# EAGLE schematic Adafruit Crickit FeatherWing (EAGLE 9.0.0)

## Sheet 1 of 3
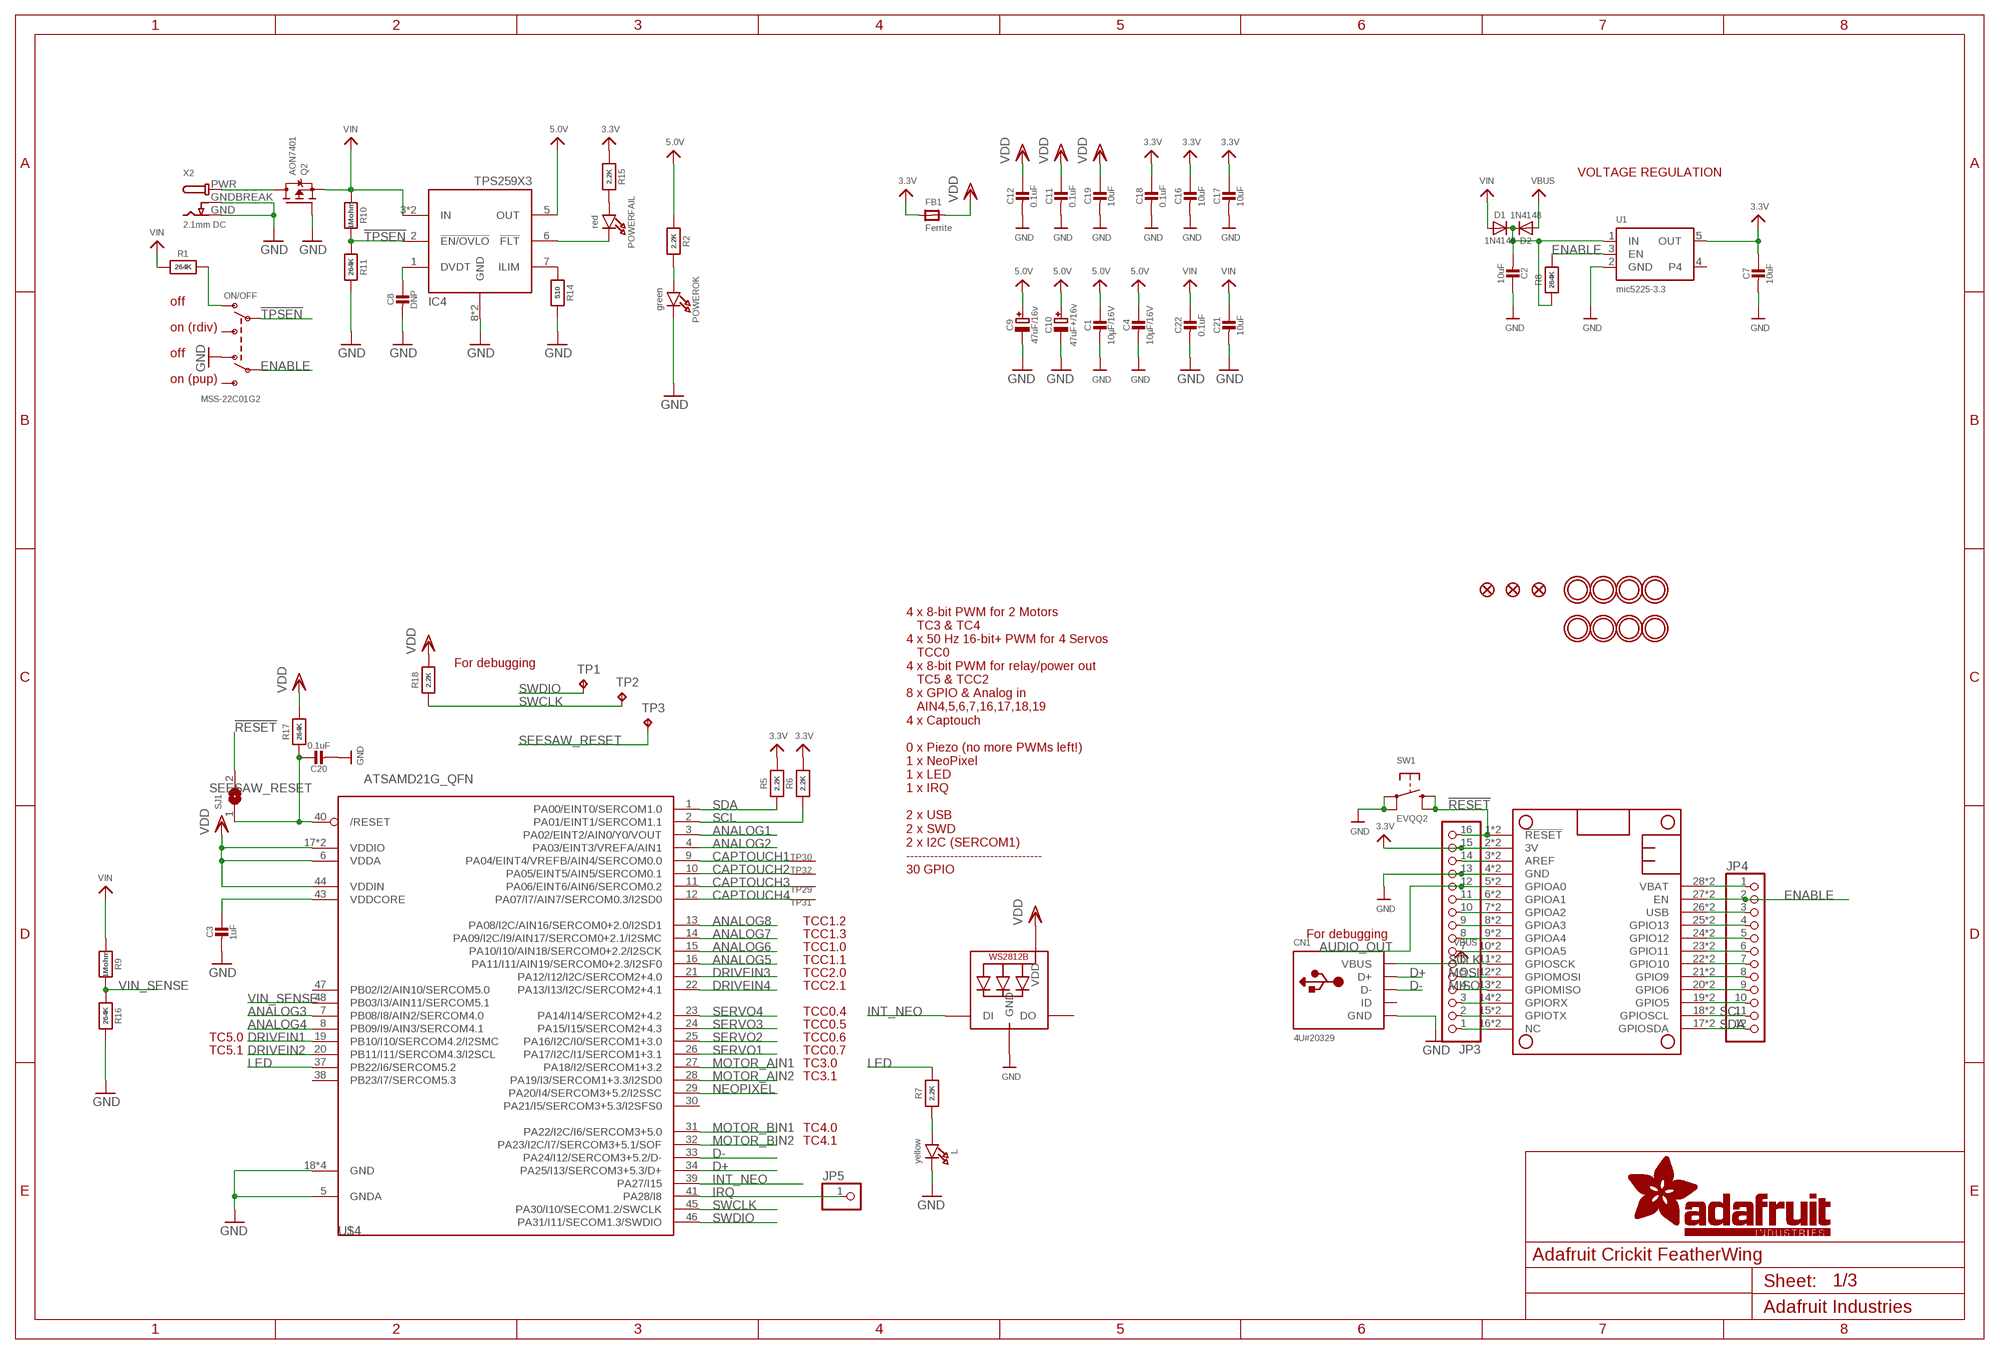
[diagram p0: schematic, sheet 1]

### Parts
C1  10µF/16V  CAP_CERAMIC0805-NOOUTLINE  [0805-NO]
C2  10uF  CAP_CERAMIC0805-NOOUTLINE  [0805-NO]
C3  1uF  CAP_CERAMIC0805_10MGAP  [0805_10MGAP]
C4  10µF/16V  CAP_CERAMIC0805-NOOUTLINE  [0805-NO]
C7  10uF  CAP_CERAMIC0805-NOOUTLINE  [0805-NO]
C8  DNP  CAP_CERAMIC0603_NO  [0603-NO]
C9  47uF/16v  CAP_ELECTROLYTICPANASONIC_C  [PANASONIC_C]
C10  47uF+/16v  CAP_ELECTROLYTICPANASONIC_C  [PANASONIC_C]
C11  0.1uF  CAP_CERAMIC0805-NOOUTLINE  [0805-NO]
C12  0.1uF  CAP_CERAMIC0805-NOOUTLINE  [0805-NO]
C16  10uF  CAP_CERAMIC0805-NOOUTLINE  [0805-NO]
C17  10uF  CAP_CERAMIC0805-NOOUTLINE  [0805-NO]
C18  0.1uF  CAP_CERAMIC0805-NOOUTLINE  [0805-NO]
C19  10uF  CAP_CERAMIC0805-NOOUTLINE  [0805-NO]
C20  0.1uF  CAP_CERAMIC0805-NOOUTLINE  [0805-NO]
C21  10uF  CAP_CERAMIC0805-NOOUTLINE  [0805-NO]
C22  0.1uF  CAP_CERAMIC0805-NOOUTLINE  [0805-NO]
CN1  4U#20329  USB_MICRO_20329_V2  [4UCONN_20329_V2]
D1  1N4148  DIODESOD-323  [SOD-323]
D2  1N4148  DIODESOD-323  [SOD-323]
FB1  Ferrite  FERRITE-0805NO  [0805-NO]
FID1  FIDUCIAL_1MM  [FIDUCIAL_1MM]
FID2  FIDUCIAL_1MM  [FIDUCIAL_1MM]
FID3  FIDUCIAL_1MM  [FIDUCIAL_1MM]
IC4  TPS259573  TPS2595X3  [WSON8]
JP3  HEADER-1X16ROUND  [1X16_ROUND]
JP4  HEADER-1X12  [1X12_ROUND]
JP5  HEADER-1X1ROUND  [1X01_ROUND]
L  yellow  LED0805_NOOUTLINE  [CHIPLED_0805_NOOUTLINE]
LED1  WS2812B3535  [LED3535]
MS2  FEATHERWING_SMTDUAL  [FEATHERWING_SMT2]
ON/OFF  MSS-22C01G2  SWITCH_DPDTEG1390  [EG1390]
POWERFAIL  red  LED0805_NOOUTLINE  [CHIPLED_0805_NOOUTLINE]
POWEROK  green  LED0805_NOOUTLINE  [CHIPLED_0805_NOOUTLINE]
Q2  AON7401  MOSFET-P-POWERDI3333  [POWERDI3333]
R1  264K  RESISTOR_0603_NOOUT  [0603-NO]
R2  2.2K  RESISTOR_0603_NOOUT  [0603-NO]
R5  2.2K  RESISTOR_0603_NOOUT  [0603-NO]
R6  2.2K  RESISTOR_0603_NOOUT  [0603-NO]
R7  2.2K  RESISTOR_0603_NOOUT  [0603-NO]
R8  264K  RESISTOR_0603_NOOUT  [0603-NO]
R9  1Mohm  RESISTOR_0603_NOOUT  [0603-NO]
R10  1Mohm  RESISTOR_0603_NOOUT  [0603-NO]
R11  264K  RESISTOR_0603_NOOUT  [0603-NO]
R14  510  RESISTOR_0603_NOOUT  [0603-NO]
R15  2.2K  RESISTOR_0603_NOOUT  [0603-NO]
R16  264K  RESISTOR_0603_NOOUT  [0603-NO]
R17  264K  RESISTOR_0603_NOOUT  [0603-NO]
R18  2.2K  RESISTOR_0603_NOOUT  [0603-NO]
SJ1  SOLDERJUMPERCLOSED  [SOLDERJUMPER_CLOSEDWIRE]
SW1  EVQQ2  SWITCH_TACT_SMT_EVQQ2_SMALL  [EVQ-Q2_SMALLER]
TP1  TPTP15R  [TP15R]
TP2  TPTP15R  [TP15R]
TP3  TPTP15R  [TP15R]
TP29  SEWTAPPCB_ALLIGATOR  [PCB_ALLI]
TP30  SEWTAPPCB_ALLIGATOR  [PCB_ALLI]
TP31  SEWTAPPCB_ALLIGATOR  [PCB_ALLI]
TP32  SEWTAPPCB_ALLIGATOR  [PCB_ALLI]
U1  mic5225-3.3  VREG_SOT23-5  [SOT23-5]
U$4  ATSAMD21G_QFN  [TQFN48_7MM]
U$41  MOUNTINGHOLE3.0_NPH  [MOUNTINGHOLE_3.0_NPH]
U$42  MOUNTINGHOLE3.0_NPH  [MOUNTINGHOLE_3.0_NPH]
U$43  MOUNTINGHOLE3.0_NPH  [MOUNTINGHOLE_3.0_NPH]
U$44  MOUNTINGHOLE3.0_NPH  [MOUNTINGHOLE_3.0_NPH]
U$49  MOUNTINGHOLE3.0_NPH  [MOUNTINGHOLE_3.0_NPH]
U$50  MOUNTINGHOLE3.0_NPH  [MOUNTINGHOLE_3.0_NPH]
U$51  MOUNTINGHOLE3.0_NPH  [MOUNTINGHOLE_3.0_NPH]
U$52  MOUNTINGHOLE3.0_NPH  [MOUNTINGHOLE_3.0_NPH]
X2  2.1mm DC  DCBARRELPTH  [DCJACK_2MM_PTH]

### Nets
3.3V [thickpower]: C7.1 C16.1 C17.1 C18.1 FB1.1 JP3.15 MS2.2'(3V) MS2.2(3V) R5.2 R6.2 R15.1 U1.5(OUT) ; also sheet 2,3
5.0V [thickpower]: C1.1 C4.1 C9.+ C10.+ IC4.5(OUT) R2.1 ; also sheet 2,3
!RESET: JP3.16 MS2.1'(!RESET) MS2.1(!RESET) SJ1.2 SW1.B'(S1) SW1.B(S)
!TPSEN: IC4.2(!EN/OVLO) ON/OFF.P1 R10.2 R11.1
ANALOG1: U$4.3(PA02/EINT2/AIN0/Y0/VOUT) ; also sheet 3
ANALOG2: U$4.4(PA03/EINT3/VREFA/AIN1) ; also sheet 3
ANALOG3: U$4.7(PB08/I8/AIN2/SERCOM4.0) ; also sheet 3
ANALOG4: U$4.8(PB09/I9/AIN3/SERCOM4.1) ; also sheet 3
ANALOG5: U$4.16(PA11/I11/AIN19/SERCOM0+2.3/I2SF0) ; also sheet 3
ANALOG6: U$4.15(PA10/I10/AIN18/SERCOM0+2.2/I2SCK) ; also sheet 3
ANALOG7: U$4.14(PA09/I2C/I9/AIN17/SERCOM0+2.1/I2SMC) ; also sheet 3
ANALOG8: U$4.13(PA08/I2C/AIN16/SERCOM0+2.0/I2SD1) ; also sheet 3
AREF: JP3.14 MS2.3'(AREF) MS2.3(AREF)
AUDIO_OUT: JP3.12 MS2.5'(GPIOA0) MS2.5(GPIOA0) ; also sheet 3
B: JP3.11 MS2.6'(GPIOA1) MS2.6(GPIOA1)
C: JP3.10 MS2.7'(GPIOA2) MS2.7(GPIOA2)
CAPTOUCH1: TP30.P$1(SEW) U$4.9(PA04/EINT4/VREFB/AIN4/SERCOM0.0)
CAPTOUCH2: TP32.P$1(SEW) U$4.10(PA05/EINT5/AIN5/SERCOM0.1)
CAPTOUCH3: TP29.P$1(SEW) U$4.11(PA06/EINT6/AIN6/SERCOM0.2)
CAPTOUCH4: TP31.P$1(SEW) U$4.12(PA07/I7/AIN7/SERCOM0.3/I2SD0)
D: JP3.9 MS2.8'(GPIOA3) MS2.8(GPIOA3)
D+: CN1.D+ U$4.34(PA25/I13/SERCOM3+5.3/D+)
D-: CN1.D- U$4.33(PA24/I12/SERCOM3+5.2/D-)
DRIVEIN1: U$4.19(PB10/I10/SERCOM4.2/I2SMC) ; also sheet 2
DRIVEIN2: U$4.20(PB11/I11/SERCOM4.3/I2SCL) ; also sheet 2
DRIVEIN3: U$4.21(PA12/I12/I2C/SERCOM2+4.0) ; also sheet 2
DRIVEIN4: U$4.22(PA13/I13/I2C/SERCOM2+4.1) ; also sheet 2
E: JP3.8 MS2.9'(GPIOA4) MS2.9(GPIOA4)
ENABLE: JP4.2 MS2.27'(EN) MS2.27(EN) ON/OFF.P2 R8.2 U1.3(EN)
F: JP3.7 MS2.10'(GPIOA5) MS2.10(GPIOA5)
G: JP3.1 MS2.16'(NC) MS2.16(NC)
GND: C1.2 C2.1 C3.2 C4.2 C7.2 C8.2 C9.- C10.- C11.2 C12.2 C16.2 C17.2 C18.2 C19.2 C20.2 C21.2 C22.2 CN1.BASE@1(GND) CN1.BASE@2(GND) CN1.GND CN1.SPRT@1(GND) CN1.SPRT@2(GND) CN1.SPRT@3(GND) CN1.SPRT@4(GND) IC4.8(GND) IC4.PAD(GND) JP3.13 L.C LED1.4(GND) MS2.4'(GND) MS2.4(GND) ON/OFF.O2 POWEROK.C Q2.4(G) R11.2 R14.2 R16.2 SW1.A'(P1) SW1.A(P) U1.2(GND) U$4.5(GNDA) U$4.18(GND) U$4.35(GND) U$4.42(GND) U$4.THERMAL(GND) X2.GND X2.GNDBREAK ; also sheet 2,3
INT_NEO: LED1.1(DI) U$4.39(PA27/I15)
IRQ: JP5.1 U$4.41(PA28/I8)
L: JP4.6 MS2.23'(GPIO11) MS2.23(GPIO11)
LED: R7.2 U$4.37(PB22/I6/SERCOM5.2)
M: JP4.5 MS2.24'(GPIO12) MS2.24(GPIO12)
MISO: JP3.4 MS2.13'(GPIOMISO) MS2.13(GPIOMISO)
MOSI: JP3.5 MS2.12'(GPIOMOSI) MS2.12(GPIOMOSI)
MOTOR_AIN1: U$4.27(PA18/I2/SERCOM1+3.2) ; also sheet 2
MOTOR_AIN2: U$4.28(PA19/I3/SERCOM1+3.3/I2SD0) ; also sheet 2
MOTOR_BIN1: U$4.31(PA22/I2C/I6/SERCOM3+5.0) ; also sheet 2
MOTOR_BIN2: U$4.32(PA23/I2C/I7/SERCOM3+5.1/SOF) ; also sheet 2
N: JP4.4 MS2.25'(GPIO13) MS2.25(GPIO13)
N$2: C2.2 D1.C D2.C R8.1 U1.1(IN)
N$4: ON/OFF.O1 R1.2
N$5: L.A R7.1
N$6: JP4.7 MS2.22'(GPIO10) MS2.22(GPIO10)
N$7: JP4.8 MS2.21'(GPIO9) MS2.21(GPIO9)
N$8: IC4.7(ILIM) R14.1
N$9: JP4.9 MS2.20'(GPIO6) MS2.20(GPIO6)
N$10: JP4.10 MS2.19'(GPIO5) MS2.19(GPIO5)
N$12: POWERFAIL.A R15.2
N$13: IC4.6(!FLT) POWERFAIL.C
N$14: C8.1 IC4.1(DVDT)
N$16: POWEROK.A R2.2
NEOPIXEL: U$4.29(PA20/I4/SERCOM3+5.2/I2SSC) ; also sheet 3
PWR [thickpower]: Q2.5678(D) X2.PWR
RX: JP3.3 MS2.14'(GPIORX) MS2.14(GPIORX)
SCL: JP4.11 MS2.18'(GPIOSCL) MS2.18(GPIOSCL) R6.1 U$4.2(PA01/EINT1/SERCOM1.1)
SCLK: JP3.6 MS2.11'(GPIOSCK) MS2.11(GPIOSCK)
SDA: JP4.12 MS2.17'(GPIOSDA) MS2.17(GPIOSDA) R5.1 U$4.1(PA00/EINT0/SERCOM1.0)
SEESAW_RESET: C20.1 R17.1 SJ1.1 TP3.TP U$4.40(/RESET)
SERVO1: U$4.26(PA17/I2C/I1/SERCOM1+3.1) ; also sheet 2
SERVO2: U$4.25(PA16/I2C/I0/SERCOM1+3.0) ; also sheet 2
SERVO3: U$4.24(PA15/I15/SERCOM2+4.3) ; also sheet 2
SERVO4: U$4.23(PA14/I14/SERCOM2+4.2) ; also sheet 2
SWCLK: R18.1 TP2.TP U$4.45(PA30/I10/SECOM1.2/SWCLK)
SWDIO: TP1.TP U$4.46(PA31/I11/SECOM1.3/SWDIO)
TX: JP3.2 MS2.15'(GPIOTX) MS2.15(GPIOTX)
USB: JP4.3 MS2.26'(USB) MS2.26(USB)
VBAT: JP4.1 MS2.28'(VBAT) MS2.28(VBAT)
VBUS: CN1.VBUS D2.A
VDD [thinpower]: C11.1 C12.1 C19.1 FB1.2 LED1.2(VDD) R17.2 R18.2 U$4.6(VDDA) U$4.17(VDDIO) U$4.36(VDDIO) U$4.44(VDDIN)
VDDCORE: C3.1 U$4.43(VDDCORE)
VIN [thickpower]: C21.1 C22.1 D1.A IC4.3(IN) IC4.4(IN) Q2.1(S) Q2.2(S) Q2.3(S) R1.1 R9.1 R10.1
VIN_SENSE: R9.2 R16.1 U$4.48(PB03/I3/AIN11/SERCOM5.1)
Unconnected: CN1.ID LED1.3(DO) ON/OFF.S1 ON/OFF.S2 U1.4 U$4.30(PA21/I5/SERCOM3+5.3/I2SFS0) U$4.38(PB23/I7/SERCOM5.3) U$4.47(PB02/I2/AIN10/SERCOM5.0)

### Notes on the sheet
- VOLTAGE REGULATION
- off
- on (rdiv)
- off
- on (pup)
- For debugging
- 4 x 8-bit PWM for 2 Motors  ✓
     TC3 & TC4
  4 x 50 Hz 16-bit+ PWM for 4 Servos  ✓
     TCC0
  4 x 8-bit PWM for relay/power out  ✓
     TC5 & TCC2
  8 x GPIO & Analog in  ✓
     AIN4,5,6,7,16,17,18,19
  4 x Captouch  ✓
  
  0 x Piezo (no more PWMs left!)
  1 x NeoPixel ✓
  1 x LED ✓
  1 x IRQ ✓
  
  2 x USB ✓
  2 x SWD ✓
  2 x I2C (SERCOM1) ✓
  ----------------------------------
  30 GPIO
- TCC1.2
- TCC1.3 | For debugging
- TCC1.0
- TCC1.1
- TCC2.0
- TCC2.1
- TCC0.4
- TCC0.5
- TC5.0 | TCC0.6
- TC5.1 | TCC0.7
- TC3.0
- TC3.1
- TC4.0
- TC4.1

## Sheet 2 of 3
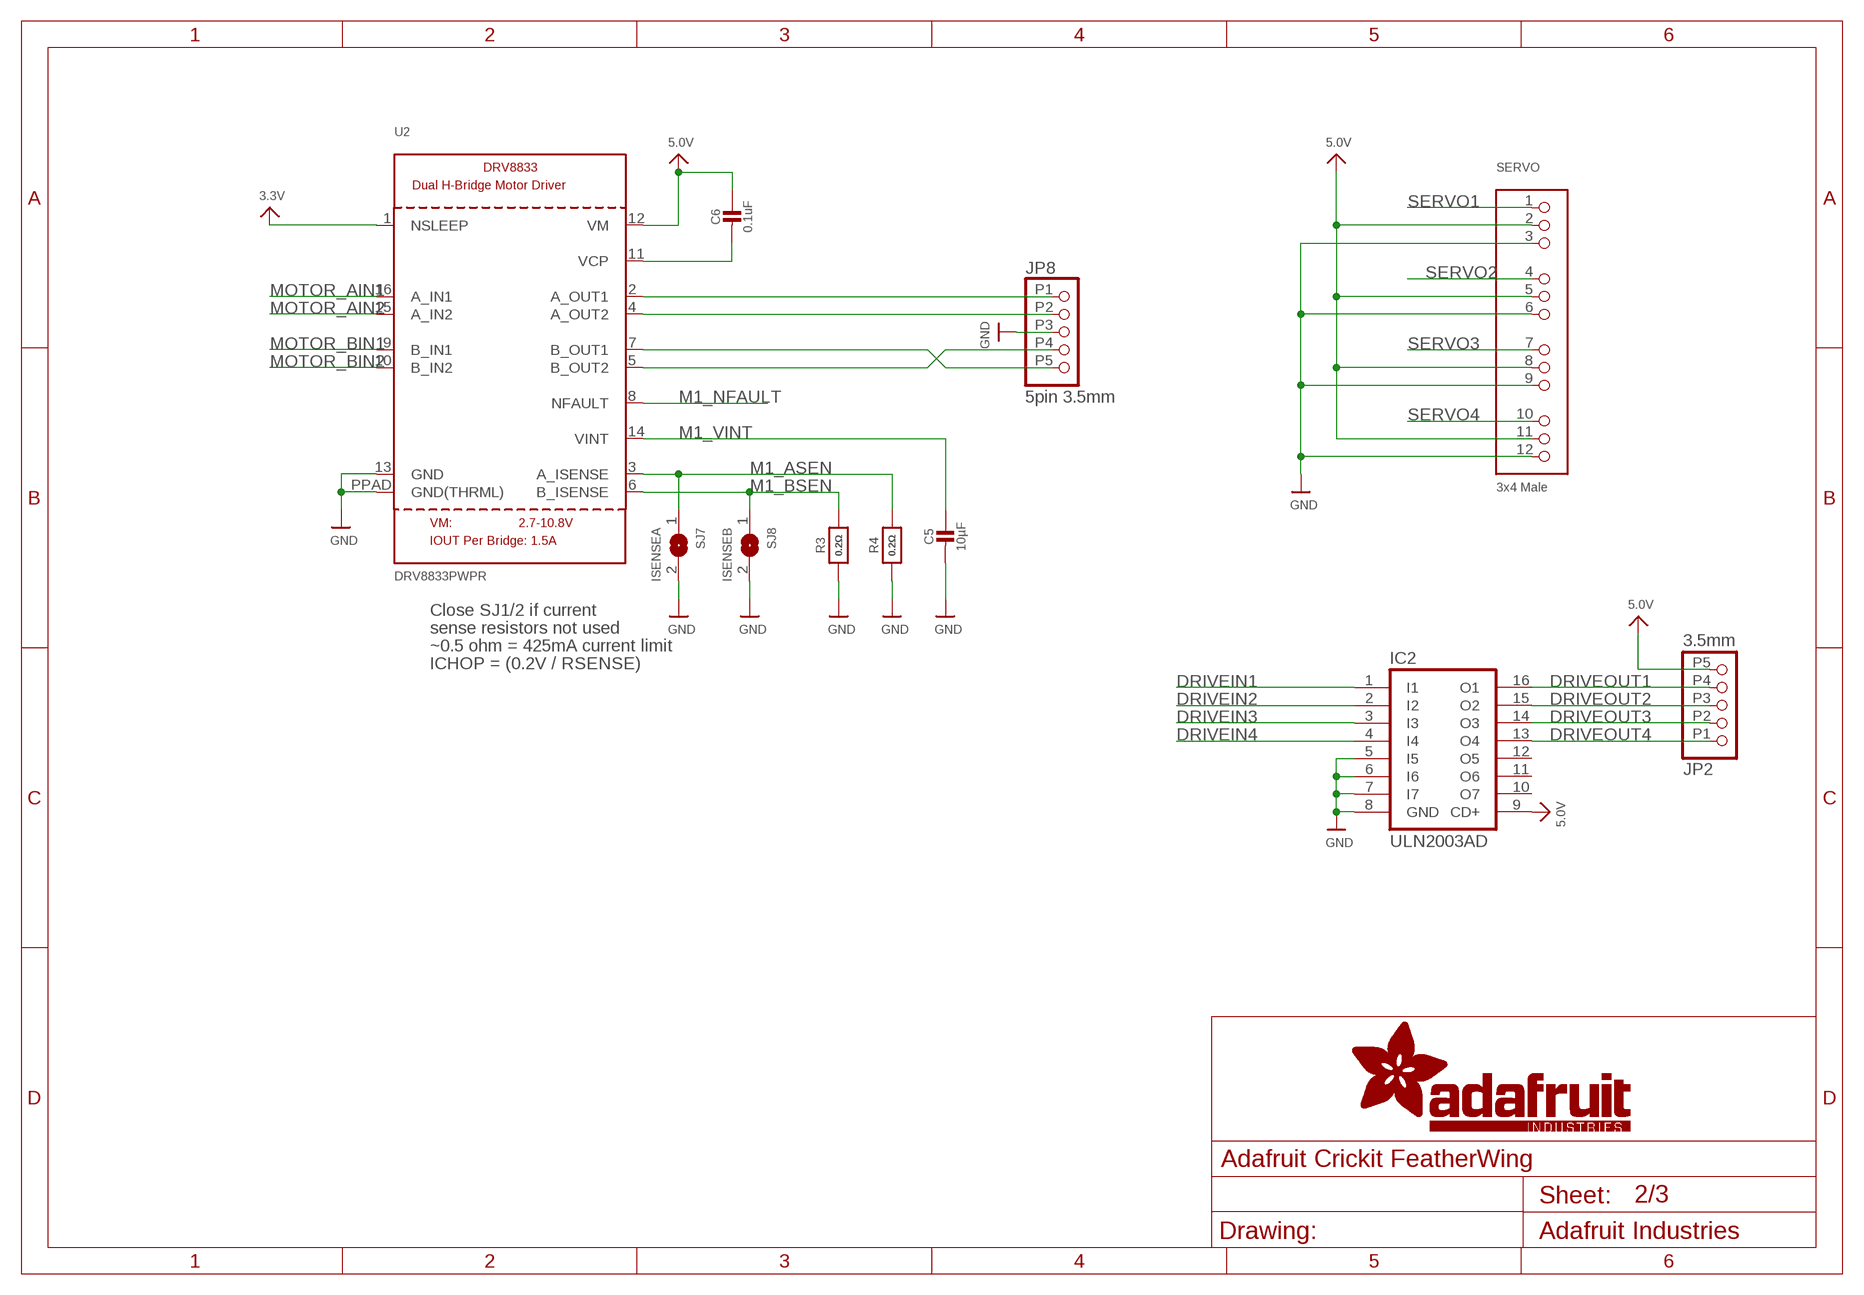
[diagram p1: schematic, sheet 2]

### Parts
C5  10µF  CAP_CERAMIC0805-NOOUTLINE  [0805-NO]
C6  0.1uF  CAP_CERAMIC0805-NOOUTLINE  [0805-NO]
IC2  ULN2003AD  [SO16]
JP2  3.5mm  HEADER-1X5_3.5TERMINAL  [TERMBLOC_1X5-3.5MM]
JP8  5pin 3.5mm  HEADER-1X5_3.5TERMINAL  [TERMBLOC_1X5-3.5MM]
R3  0.2Ω  RESISTOR_1206  [_1206]
R4  0.2Ω  RESISTOR_1206  [_1206]
SERVO  3x4 Male  HEADER-3X04  [3X04]
SJ7  ISENSEA  SOLDERJUMPER  [SOLDERJUMPER_ARROW_NOPASTE]
SJ8  ISENSEB  SOLDERJUMPER  [SOLDERJUMPER_ARROW_NOPASTE]
U2  DRV8833PWPR  DRV8833  [HTSSOP16]

### Nets
3.3V [thickpower]: U2.1(NSLEEP) ; also sheet 1,3
5.0V [thickpower]: C6.1 IC2.9(CD+) JP2.P5 SERVO.2 SERVO.5 SERVO.8 SERVO.11 U2.12(VM) ; also sheet 1,3
AOUT3: JP8.P1 U2.2(A_OUT1)
AOUT4: JP8.P2 U2.4(A_OUT2)
DRIVEIN1: IC2.1(I1) ; also sheet 1
DRIVEIN2: IC2.2(I2) ; also sheet 1
DRIVEIN3: IC2.3(I3) ; also sheet 1
DRIVEIN4: IC2.4(I4) ; also sheet 1
DRIVEOUT1: IC2.16(O1) JP2.P4
DRIVEOUT2: IC2.15(O2) JP2.P3
DRIVEOUT3: IC2.14(O3) JP2.P2
DRIVEOUT4: IC2.13(O4) JP2.P1
GND: C5.2 IC2.5(I5) IC2.6(I6) IC2.7(I7) IC2.8(GND) JP8.P3 R3.1 R4.1 SERVO.3 SERVO.6 SERVO.9 SERVO.12 SJ7.2 SJ8.2 U2.13(GND) U2.PPAD(GND(THRML)) ; also sheet 1,3
M1_ASEN: R4.2 SJ7.1 U2.3(A_ISENSE)
M1_BSEN: R3.2 SJ8.1 U2.6(B_ISENSE)
M1_NFAULT: U2.8(NFAULT)
M1_VINT: C5.1 U2.14(VINT)
MOTOR_AIN1: U2.16(A_IN1) ; also sheet 1
MOTOR_AIN2: U2.15(A_IN2) ; also sheet 1
MOTOR_BIN1: U2.9(B_IN1) ; also sheet 1
MOTOR_BIN2: U2.10(B_IN2) ; also sheet 1
N$1: C6.2 U2.11(VCP)
N$15: JP8.P5 U2.7(B_OUT1)
N$17: JP8.P4 U2.5(B_OUT2)
SERVO1: SERVO.1 ; also sheet 1
SERVO2: SERVO.4 ; also sheet 1
SERVO3: SERVO.7 ; also sheet 1
SERVO4: SERVO.10 ; also sheet 1
Unconnected: IC2.10(O7) IC2.11(O6) IC2.12(O5)

### Notes on the sheet
- Close SJ1/2 if current
- sense resistors not used
- ~0.5 ohm = 425mA current limit
- ICHOP = (0.2V / RSENSE)

## Sheet 3 of 3
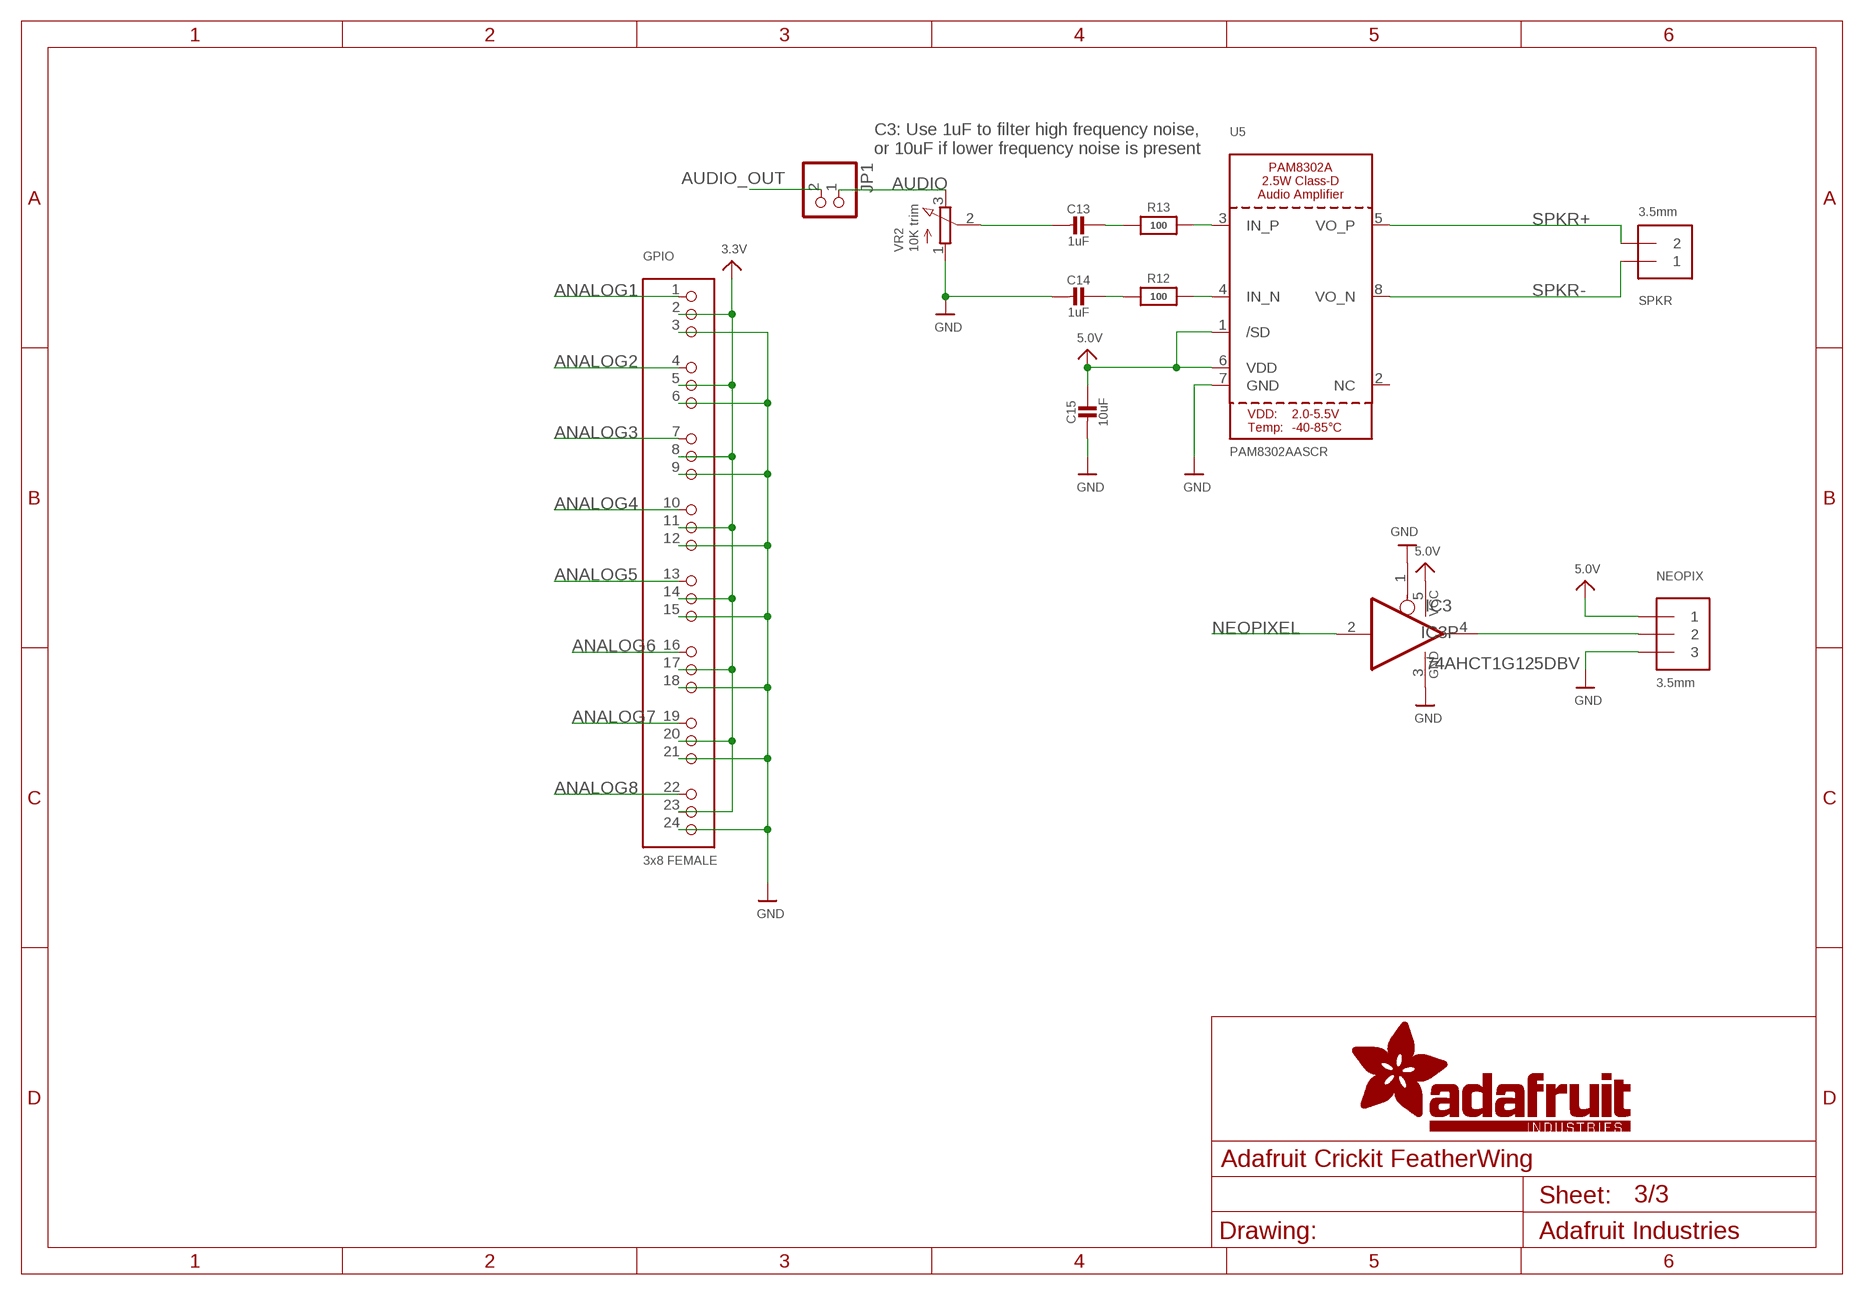
[diagram p2: schematic, sheet 3]

### Parts
C13  1uF  CAP_CERAMIC0805-NOOUTLINE  [0805-NO]
C14  1uF  CAP_CERAMIC0805-NOOUTLINE  [0805-NO]
C15  10uF  CAP_CERAMIC0805-NOOUTLINE  [0805-NO]
GPIO  3x8 FEMALE  HEADER-3X08  [3X08]
IC3  74AHCT1G125DBV  [SOT23-5]
JP1  HEADER-1X2ROUND  [1X02_ROUND]
NEOPIX  3.5mm  TERMBLOCK_1X3  [TERMBLOCK_1X3-3.5MM]
R12  100  RESISTOR0805_NOOUTLINE  [0805-NO]
R13  100  RESISTOR0805_NOOUTLINE  [0805-NO]
SPKR  3.5mm  TERMBLOCK_1X2  [TERMBLOCK_1X2-3.5MM]
U5  PAM8302AASCR  AUDIOAMP_PAM8302A  [MSOP8_0.65MM]
VR2  10K trim  TRIMPOT3303W/X  [TRIMPOT_BOURNS_3303W]

### Nets
3.3V [thickpower]: GPIO.2 GPIO.5 GPIO.8 GPIO.11 GPIO.14 GPIO.17 GPIO.20 GPIO.23 ; also sheet 1,2
5.0V [thickpower]: C15.1 IC3.5(VCC) NEOPIX.1 U5.1(/SD) U5.6(VDD) ; also sheet 1,2
ANALOG1: GPIO.1 ; also sheet 1
ANALOG2: GPIO.4 ; also sheet 1
ANALOG3: GPIO.7 ; also sheet 1
ANALOG4: GPIO.10 ; also sheet 1
ANALOG5: GPIO.13 ; also sheet 1
ANALOG6: GPIO.16 ; also sheet 1
ANALOG7: GPIO.19 ; also sheet 1
ANALOG8: GPIO.22 ; also sheet 1
AUDIO: JP1.1 VR2.3(E)
AUDIO_OUT: JP1.2 ; also sheet 1
GND: C14.2 C15.2 GPIO.3 GPIO.6 GPIO.9 GPIO.12 GPIO.15 GPIO.18 GPIO.21 GPIO.24 IC3.1(OE) IC3.3(GND) NEOPIX.3 U5.7(GND) VR2.1(A) ; also sheet 1,2
N$3: IC3.4(O) NEOPIX.2
N$19: R12.2 U5.4(IN_N)
N$20: R13.2 U5.3(IN_P)
N$21: C14.1 R12.1
N$22: C13.1 R13.1
N$23: C13.2 VR2.2(S)
NEOPIXEL: IC3.2(I) ; also sheet 1
SPKR+: SPKR.2 U5.5(VO_P)
SPKR-: SPKR.1 U5.8(VO_N)
Unconnected: U5.2(NC)

### Notes on the sheet
- C3: Use 1uF to filter high frequency noise,
  or 10uF if lower frequency noise is present

## Library data of the parts
C1-C8 C11-C22 = microbuilder:CAP_CERAMIC: Ceramic Capacitors For new designs, use the packages preceded by an '_' character since they are more reliable: The following footprints should be used on most boards: _0402 - Standard footprint for regular board layouts _0603 - Standard footprint for regular board layouts _0805 - Standard footprint for regular board layouts _1206 - Standard footprint for regular board layouts For extremely tight-pitch boards where space is at a premium, the following 'micro-pitch' footprints can be used (smaller pads, no silkscreen outline, etc.): _0402MP - Micro-pitch footprint for very dense/compact boards _0603MP - Micro-pitch footprint for very dense/compact boards _0805MP - Micro-pitch footprint for very dense/compact boards _1206MP - Micro-pitch footprint for very dense/compact boards
C9 C10 = microbuilder:CAP_ELECTROLYTIC: Electrolytic Capacitors SMT PANASONIC_C - Size C Panasonic Electrolytic Aluminum Capacitor 47µF 16V 20% Electrolytic Capacitor [Digikey: PCE3890TR-ND] PANASONIC_D - Size D Panasonic Electrolytic Aluminum Capacitor 100µF 25V 20% Electrolytic Capacitor [Digikey: PCE3898TR-ND] PTH 3.5 mm grid, 8 mm diameter ... 3.5 mm grid, 10 mm diameter ...
CN1 = microbuilder:USB: USB Connectors USBMINIB - Surface Mount Female Mini-B USB Connector 4UConnector: 06564
D1 D2 = microbuilder:DIODE: Diode SMA Model Volts Amps Type Vf Ir Digikey # Notes SSA34-E3 40V 3A Schottky 480mV @ 3A 200uA @ 40V SSA34-E3/61TGITR-ND CDBA120-G 20V 1A Schottky 500mV @ 1A 500uA @ 20V 641-1014-6-ND REEL MBRA210 10V 2A Schottky 350mV @ 2A 700uA @ 10V MBRA210LT3 SOD-123 Model Volts Amps Type Vf Ir Order # Notes BAT54T1G 30V 200mA Schottky 800mV @ 200mA 2uA @ 25V BAT54T1GOSTR-ND B0530W 30V 500mA Schottky 430mV @ 500mA 130uA @ 30V B0530W-FDICT-ND REEL MBR120 20V 1A Schottky 340mV @ 1A MBR120VLSFT1GOSCT-ND SOD-323 Model Volts Amps Type Vf Ir Order # Notes PMEG2005EJ 20V 500mA Schottky 355mV @ 500mA 568-4110-1-ND ZLLS410 10V 570mA Schottky 380mV @ 570mA ZLLS410CT-ND 1N4148WS 75V 150mA Silicon/Simple 1V 1N4148WSFSCT-ND REEL SOD-523 Model Volts Amps Type Vf Ir Order # Notes BAT54XV2 30V 200mA Schottky 0.8V @ 100mA BAT54XV2CT-ND TB751S 30V 30mA Schottky RB751S-40TE61CT-ND SOT23-R/W (R = Solder Paste/Reflow Ovens, W = Hand-Soldering) Model Volts Amps Type Vf Ir Order # Notes BAT54FILM 40V 300mA Schottky 497-7162-1-ND POWERDI-5 Model Volts Amps Type Vf Ir Order # Notes PDS560 60V 5A Schottky 670mV @ 5A 150uA @ 60V PDS560DICT-ND
FB1 = microbuilder:FERRITE: Ferrite Bead 0603 MMZ1608B121C - 120 Ohm @ 100MHz, 600mA, 0.15 Ohm DC Resistance - Digikey: 445-2164-1-ND BK1608HW121-T - 120 Ohm, 600mA Ferrite Chip - Digikey: 587-1876-2-ND 0805 HZ0805B272R-10 - 2.7K Ohm @ 100MHz, 200mA, 0.8 Ohm DC Resistance - Digikey: 240-2504-1-ND (see also Murata BLM21BD272SN1L) MMZ2012Y152B - 1.5K Ohm @ 100MHz, 500mA, 0.4 Ohm DC Resistance - Digikey: 445-1560-1-ND - Mainly for high frequency (80-400MHz) MMZ2012R102A - 1K Ohm @ 100MHz, 500mA, 0.3 Ohm DC Resistance - Digikey: 445-1555-2-ND - More general purpose (10-200MHz)
FID1-FID3 = microbuilder:FIDUCIAL: Fiducial Alignment Points Various fiducial points for machine vision alignment.; BOM: EXCLUDE
GPIO = microbuilder:HEADER-3X08: 3x8 0.1" Headers Male - 4UCON: 01058
IC2 = uln-udn:ULN2003A: DRIVER ARRAY
IC3 = 74xx-little-us:74*1G125: Single Bus Buffer Gate with 3-State Output
IC4 = microbuilder:TPS2595X3
JP1 = microbuilder:HEADER-1X2: PIN HEADER
JP2 JP8 = microbuilder:HEADER-1X5: PIN HEADER
JP3 = microbuilder:HEADER-1X16: PIN HEADER
JP4 = microbuilder:HEADER-1X12
JP5 = microbuilder:HEADER-1X1: PIN HEADER
L POWERFAIL POWEROK = microbuilder:LED: LED 0603 - 0603 Surface Mount Package 2mA: Green LED - Low Power (3.9mcd, 2ma, 1.7Vf) - Digikey: 475-2709-2-ND Orange LED - Low Power (9.8mcd, 2ma, 1.8Vf) - Digikey: 475-1194-2-ND Red LED - Low Power (5mcd, 2ma, 1.8Vf) - Digikey: 475-1195-2-ND Yellow LED - Low Power (7mcd, 2ma, 1.8Vf) - Digikey: 475-1196-2-ND 5mA: Blue LED - Low Power (17mcd, 5ma, 2.9Vf) - Digikey: LNJ937W8CRACT-ND 0805 - 0805 Surface Mount Package 2mA: Red LED (8.8mcd, 2mA, 1.8Vf, Clear) - Low Power [Digikey: 475-2510-1-ND] Green LED (5mcd, 2mA, 1.8Vf, Clear) - Low Power [Digikey: 475-2730-1-ND] Yellow LED (11.3mcd, 2mA, 1.8Vf, Clear) - Low Power [Digikey: 475-2555-1-ND] 20mA: Red LED (104mcd, 20mA, Diffused) - LS R976 [Digikey: 475-1278-6-ND] Red LED (12mcd, 20mA, 2.0Vf, Clear) - APT2012EC [Digikey: 754-1128-1-ND] Green LED (15mcd, 20mA, 2.2Vf, Clear) - APT2012GC [Digikey: 754-1131-1-ND] Orange LED (160mcd, 20mA, 2.1Vf, Clear) - APT2012SECK [Digikey: 754-1130-1-ND] 1206 - 1206 Surface Mount Package Green LED (26mcd, 20mA, Diffused) - LG N971 [Digikey: 475-1407-6-ND] Red LED (15mcd, 20mA, Diffused) - LH N974 [Digikey: 475-1416-6-ND] Cree - Cree High-Power Surface Mount LEDs XPEBWT-L1-0000-00D50 - White 111lm 350mA 2.9Vf 6200K 110° XTEAWT-00-0000-00000LEE3 - White 114lm 350mA 2.85Vf 5000K 115° Everlight - Everlight 45-21 Series Surface Mount LEDs 45-21/QK2C-B2832AC2CB2/2T - Warm White 2000mcd 20mA 3.25Vf 3050K 120° 45-21/LK2C-B38452C4CB2/2T - Nuetral White 2000mcd 20mA 3.25Vf 4150K 120° 45-21/LK2C-B50634C6CB2/2T - Cold White 2200mcd 20mA 3.25Vf 5650K 120° PLCC2 Reverse Mount LS T77K-J1L2-1-0-2-R18-Z - Red 11.25mcd 2mA 1.8Vf 630nm 120° LO T77K-L1M2-24-Z - Orange 19.6mcd 2mA 1.8Vf 606nm 120° LY T77K-K2M1-26-Z - Yellow 15.7mcd 2mA 1.8Vf 587nm 120°
LED1 = microbuilder:WS2812B
MS2 = microbuilder:FEATHERWING
NEOPIX = microbuilder:TERMBLOCK_1X3: 3.5mm Terminal block http://www.ladyada.net/library/pcb/eaglelibrary.html
ON/OFF = microbuilder:SWITCH_DPDT: Switch - DPDT A DPDT Switch acts like an SPDT switch, but has a pair of switches instead of just one. Vertical - 0.3A @ 6V SMT - Digikey: JS202011SCQN
Q2 = microbuilder:MOSFET-P: P-Channel Mosfet LEGEND VDS: Voltage Drain-Source ID: Drain Current RDS(ON): Drain-Source On-State Resistance VGS(TH): Gate-Source Threshold Voltage CISS: Drain-Source Input Capacitance SOT-23 Name VDS ID RDS(ON) VGS(TH) CISS Order Number IRLML5103 30V 760mA 600 mOhm -- 75pF @ 25V Digikey: IRLML5103PBFCT-ND IRLML6401 12V 4.3A 50 mOhm 950mV @ 250µA 830pF @ 10V Digikey: IRLML6401PBFTR-ND NTR0202PL 20V 400mA 800 mOhm 2.3V @ 250uA 70pF @ 5V Digikey: NTR0202PLT1GOSTR-ND NTR4101PT1G 20V 1.8A 85 mOhm 1.2V @ 250uA 675pF @ 10V Digikey: NTR4101PT1GOSCT-ND DMP2004K 20V 600mA 900 mOhm 1V @ 250uA 175pF @ 16V Digikey: DMP2004KDICT-ND PMV65XP 20V 3.9A 76 mOhm 950mV @ 1mA 725pF @ 20V Digikey: 568-2358-2-ND TO-252 Name VDS ID RDS(ON) VGS(TH) CISS Order Number AOD417 30V 25A 34 mOhm 3V @ 250µA 920pF @ 15V Digikey: 785-1106-2-ND PowerPak Name VDS ID RDS(ON) VGS(TH) CISS Order Number AON7401 30V 12A 14 mOhm 3V @ 250µA 2600pF @ 15V Digikey: 785-1302-1-ND
R1-R18 = microbuilder:RESISTOR: Resistors For new designs, use the packages preceded by an '_' character since they are more reliable: The following footprints should be used on most boards: _0402 - Standard footprint for regular board layouts _0603 - Standard footprint for regular board layouts _0805 - Standard footprint for regular board layouts _1206 - Standard footprint for regular board layouts For extremely tight-pitch boards where space is at a premium, the following 'micro-pitch' footprints can be used (smaller pads, no silkscreen outline, etc.): _0402MP - Micro-pitch footprint for very dense/compact boards _0603MP - Micro-pitch footprint for very dense/compact boards _0805MP - Micro-pitch footprint for very dense/compact boards _1206MP - Micro-pitch footprint for very dense/compact boards
SERVO = microbuilder:HEADER-3X04
SJ1 = microbuilder:SOLDERJUMPER: SMD Solder JUMPER Solder the two pads together to create a connection, or remove the solder to break it. REFLOW - Use this footprint for solder paste and reflow ovens. WAVE - Use this footprint for hand-soldering (larger pads). CLOSED - Has a trace between the two pads to ensure it is closed by default. The trace needs to be cut to disable the jumper, and can be closed again by creating a solder bridge between the two pads.
SJ7 SJ8 = microbuilder:SOLDERJUMPER: SMD Solder JUMPER Solder the two pads together to create a connection, or remove the solder to break it. REFLOW - Use this footprint for solder paste and reflow ovens. WAVE - Use this footprint for hand-soldering (larger pads). CLOSED - Has a trace between the two pads to ensure it is closed by default. The trace needs to be cut to disable the jumper, and can be closed again by creating a solder bridge between the two pads.; BOM: EXCLUDE
SPKR = microbuilder:TERMBLOCK_1X2: 3.5mm Terminal block http://www.ladyada.net/library/pcb/eaglelibrary.html
SW1 = microbuilder:SWITCH_TACT_SMT: SMT Tact Switches 6x6mm - Digikey: P12940SCT-ND KMR2 (4.6x2.8mm) - Digikey: 401-1426-1-ND EVQ-PQHB55 - Light Touch, 160GF (4.5x4.5mm) - Digikey: P8090SCT-ND KMT0 - KMT021 NGJ LHS (etc.) IP68/Waterproof - Digikey: CKN10289CT-ND
TP1-TP3 = testpad:TP: Test pad
TP29-TP32 = microbuilder:SEWTAP
U1 = microbuilder:VREG_SOT23-5: SOT23-5 Fixed Voltage Regulators Part Current Out V Out V In V Dropout θJA (°C/W) TJ (°C) Digikey Part No. ADP121 150mA 3.3V 3.4-5.5V 0.09V @ 150mA -- -- ADP121-AUJZ33R7CT-ND ADP121 150mA 3.0V 3.1-5.5V 0.09V @ 150mA -- -- ADP121-AUJZ30R7CT-ND ADP122 300mA 3.3V 3.4-5.5V 0.085V @ 300mA -- -- ADP122AUJZ-3.3-R7CT-ND ADP1712 300mA 3.3V 3.5-5.5V 0.17V @ 300mA -- -- ADP1712AUJZ-3.3-R7TR-ND AP7311 (Low Cost) 150mA 3.3V 3.5-6V 0.15V @ 150mA -- -- AP7311-33WG-7DICT-ND LD39015M18R 150mA 1.8V 1.9V-5.5V 0.08V @ 100mA -- -- 497-6977-1-ND LP2985A-33DBVR 150mA 3.3V 3.3-16V 0.28V @ 150mA 206 150 296-18479-1-ND MCP1824T-3302E/OT 300mA 3.3V 3.5V-6V 0.2V @ 300mA -- -- MCP1824T-3302E/OTCT-ND MIC5205-2.5YM5 TR 150mA 2.5V 2.7-16V 0.165V @ 150mA -- -- 576-1257-2-ND MIC5205-3.0YM5 TR 150mA 3.0V 3.2V-16V 0.165V @ 150mA -- -- 576-1258-2-ND MIC5205-3.3YM5 TR 150mA 3.3V 3.5V-16V 0.165V @ 150mA -- -- 576-1259-2-ND TPS780330220 150mA 3.3V+2.2V 3.6-5.5V 250mV Max -- -- 296-23332-1-ND TDA3663/N1,135 100mA 3.3V 3.5-45V 0.18V @ 50mA -- -- 568-5343-1-ND Max operating temp can be calculated using θJA, TJ (max junction temperature), and power in watts. Set the "Maximum Ambient Temperature" until it reaches TJ ("Max Junction Temperature"), which is the absolute limit for safe use of the regulator: Heat Sink Temperature Calculator <http://www.daycounter.com/Calculators/Heat-Sink-Temperature-Calculator.phtml> For example, With 12V source into a 3.3V LP2985 and a 30mA load, we are dissipating (12V-3.3V) * 0.03A = 0.261W. With a θJA of 206 °C/W, a TJ of 150°C, and 261mW we can safely use the chip without a heat sink up to 75°C (=147.1°C Junction Temperature).
U2 = microbuilder:DRV8833: DRV8833 Dual H-Bridge Motor Driver -- HTSSOP Package
U5 = microbuilder:AUDIOAMP_PAM8302A: PAM8302A - 2.5W Class-D Mono Audio Amplifier MSOP8 = PAM8302AASCR
U$4 = microbuilder:ATSAMD21G
U$41-U$44 U$49-U$52 = microbuilder:MOUNTINGHOLE: Mounting Hole For #2 screws (0.086"/2.18mm width, 0.094"/2.4mm hole) use 2.5mm
VR2 = microbuilder:TRIMPOT: 3-Pin SMT Trimpots Bourns TC33 (X-2) Series 1K - Digikey: TC33X-102ECT-ND 10K - Digikey: TC33X-2-103E 100K - Digikey: TC33X-104ECT-ND Bourns 3303 (W) Series 3mm 10K Single Turn - Digikey: 3303W-103ETR-ND 3mm 100K Single Turn - Digikey: 3303X-104ETR-ND
X2 = microbuilder:DCBARREL: DC Barrel Jack DCJACK_1.3MM_PTH - Through Hole 1.3mm Jack (4UConnector: 05536) DCJACK_2MM_PTH - Through Hole 2.0/2.1 Jack (4UConnector: 05537) DCJACK_2MM_SMT - SMT 2.0/2.1mm Jack(4UConnector: 03267)

## Net classes
1 thinpower: width 0.305 mm
2 thickpower: width 0.406 mm